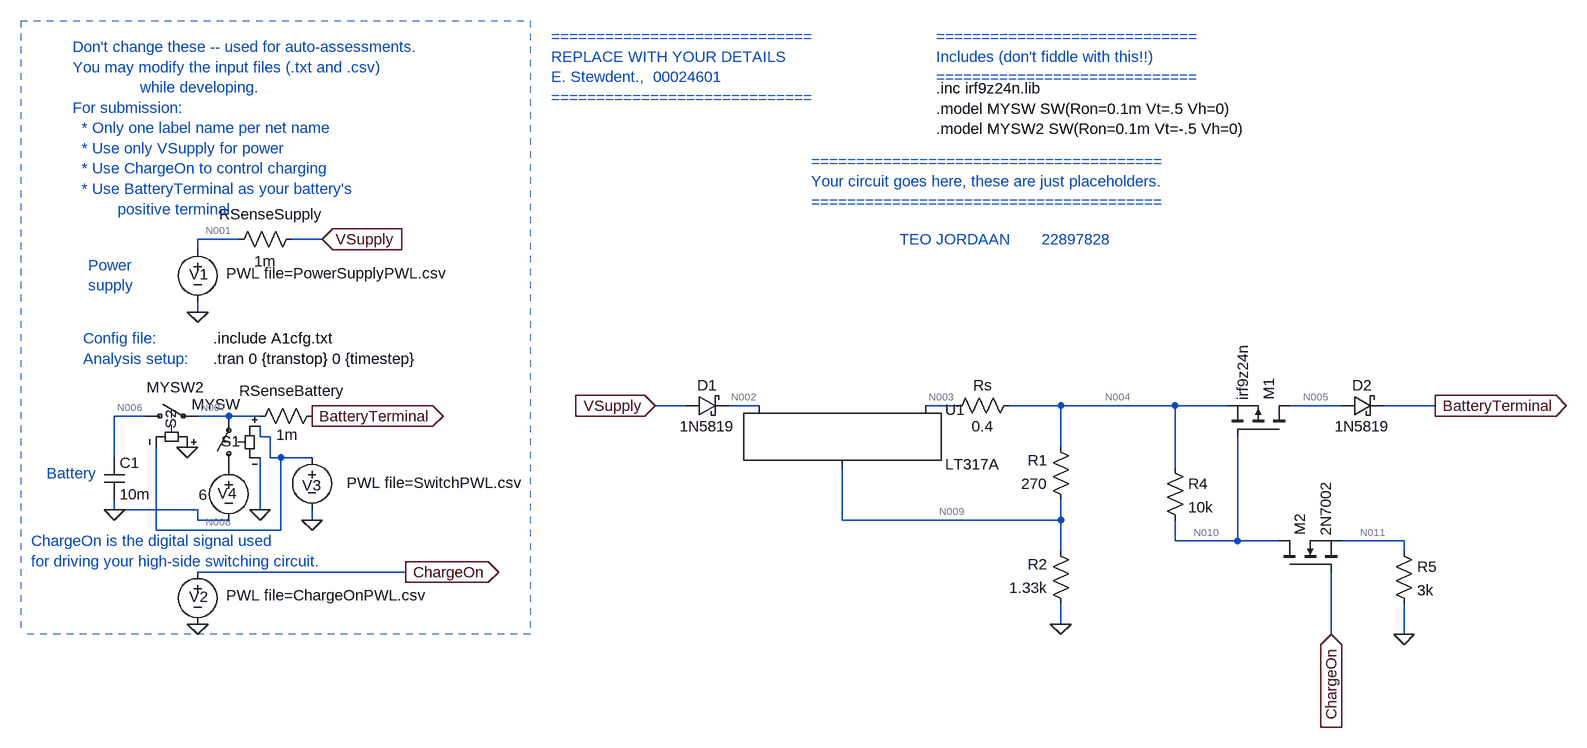
[diagram p0: schematic E344_A22897828_A2.asc]
E344_A22897828_A2.asc, the LTspice schematic file:
Version 4
SHEET 1 1824 680
WIRE -2032 -1088 -2096 -1088
WIRE -1904 -1088 -1952 -1088
WIRE -2096 -1072 -2096 -1088
WIRE -2096 -976 -2096 -992
WIRE -1344 -832 -1392 -832
WIRE -1232 -832 -1280 -832
WIRE -928 -832 -976 -832
WIRE -768 -832 -848 -832
WIRE -592 -832 -768 -832
WIRE -512 -832 -592 -832
WIRE -336 -832 -416 -832
WIRE -192 -832 -272 -832
WIRE -2176 -816 -2224 -816
WIRE -2048 -816 -2096 -816
WIRE -2000 -816 -2048 -816
WIRE -2000 -784 -2000 -800
WIRE -1984 -784 -2000 -784
WIRE -768 -768 -768 -832
WIRE -2224 -752 -2224 -816
WIRE -1984 -752 -1984 -784
WIRE -1968 -752 -1984 -752
WIRE -1920 -752 -1968 -752
WIRE -592 -736 -592 -832
WIRE -2224 -672 -2224 -688
WIRE -2096 -672 -2224 -672
WIRE -2000 -672 -2000 -752
WIRE -2096 -656 -2096 -672
WIRE -2048 -656 -2096 -656
WIRE -1920 -656 -1920 -672
WIRE -1104 -656 -1104 -736
WIRE -768 -656 -768 -688
WIRE -768 -656 -1104 -656
WIRE -2160 -640 -2160 -768
WIRE -1968 -640 -1968 -752
WIRE -1968 -640 -2160 -640
WIRE -592 -624 -592 -656
WIRE -496 -624 -496 -784
WIRE -496 -624 -592 -624
WIRE -432 -624 -496 -624
WIRE -240 -624 -336 -624
WIRE -768 -608 -768 -656
WIRE -240 -608 -240 -624
WIRE -1776 -576 -2096 -576
WIRE -768 -496 -768 -528
WIRE -352 -480 -352 -576
WIRE -240 -480 -240 -528
FLAG -2096 -976 0
FLAG -1904 -1088 VSupply
IOPIN -1904 -1088 In
FLAG -1920 -816 BatteryTerminal
IOPIN -1920 -816 Out
FLAG -1776 -576 ChargeOn
IOPIN -1776 -576 Out
FLAG -2096 -496 0
FLAG -1392 -832 VSupply
IOPIN -1392 -832 In
FLAG -192 -832 BatteryTerminal
IOPIN -192 -832 Out
FLAG -352 -480 ChargeOn
IOPIN -352 -480 In
FLAG -2000 -672 0
FLAG -1920 -656 0
FLAG -2112 -768 0
FLAG -2224 -672 0
FLAG -768 -496 0
FLAG -240 -480 0
SYMBOL voltage -2096 -1088 R0
WINDOW 123 0 0 Left 0
WINDOW 39 0 0 Left 0
WINDOW 3 44 52 Left 2
WINDOW 0 -13 54 Left 2
SYMATTR Value PWL file=PowerSupplyPWL.csv
SYMATTR InstName V1
SYMBOL res -1904 -832 R90
WINDOW 0 -7 47 VBottom 2
WINDOW 3 29 54 VTop 2
SYMATTR InstName RSenseBattery
SYMATTR Value 1m
SYMBOL res -1936 -1104 R90
WINDOW 0 -7 47 VBottom 2
WINDOW 3 34 56 VTop 2
SYMATTR InstName RSenseSupply
SYMATTR Value 1m
SYMBOL cap -2240 -752 R0
SYMATTR InstName C1
SYMATTR Value 10m
SYMATTR SpiceLine2 IC=6
SYMBOL voltage -2096 -592 R0
WINDOW 123 0 0 Left 0
WINDOW 39 0 0 Left 0
WINDOW 3 44 52 Left 2
WINDOW 0 -13 54 Left 2
SYMATTR Value PWL file=ChargeOnPWL.csv
SYMATTR InstName V2
SYMBOL PowerProducts\\LT317A -1104 -832 R0
SYMATTR InstName U1
SYMBOL pmos -416 -784 M270
SYMATTR InstName M1
SYMATTR Value irf9z24n
SYMATTR Prefix X
SYMATTR SpiceModel irf9z24n
SYMBOL nmos -432 -576 R270
SYMATTR InstName M2
SYMATTR Value 2N7002
SYMBOL schottky -1344 -816 R270
WINDOW 0 32 32 VTop 2
WINDOW 3 0 32 VBottom 2
SYMATTR InstName D1
SYMATTR Value 1N5819
SYMATTR Description Diode
SYMATTR Type diode
SYMBOL schottky -336 -816 R270
WINDOW 0 32 32 VTop 2
WINDOW 3 0 32 VBottom 2
SYMATTR InstName D2
SYMATTR Value 1N5819
SYMATTR Description Diode
SYMATTR Type diode
SYMBOL sw -2048 -720 R180
WINDOW 0 -18 57 Left 2
WINDOW 3 -17 114 Left 2
SYMATTR InstName S1
SYMATTR Value MYSW
SYMBOL voltage -1920 -768 R0
WINDOW 0 0 43 Top 2
WINDOW 3 188 70 Bottom 2
WINDOW 123 0 0 Left 0
WINDOW 39 0 0 Left 0
SYMATTR InstName V3
SYMATTR Value PWL file=SwitchPWL.csv
SYMBOL sw -2192 -816 R270
WINDOW 0 -20 55 Left 2
WINDOW 3 44 18 VRight 2
SYMATTR InstName S2
SYMATTR Value MYSW2
SYMBOL voltage -2048 -752 R0
WINDOW 0 -17 55 Left 2
WINDOW 3 -46 57 Left 2
WINDOW 123 0 0 Left 0
WINDOW 39 0 0 Left 0
SYMATTR InstName V4
SYMATTR Value 6
SYMBOL res -832 -848 R90
WINDOW 0 0 56 VBottom 2
WINDOW 3 32 56 VTop 2
SYMATTR InstName Rs
SYMATTR Value 0.4
SYMBOL res -752 -672 R180
WINDOW 0 36 76 Left 2
WINDOW 3 36 40 Left 2
SYMATTR InstName R1
SYMATTR Value 270
SYMBOL res -752 -512 R180
WINDOW 0 36 76 Left 2
WINDOW 3 36 40 Left 2
SYMATTR InstName R2
SYMATTR Value 1.33k
SYMBOL res -608 -752 R0
SYMATTR InstName R4
SYMATTR Value 10k
SYMBOL res -256 -624 R0
SYMATTR InstName R5
SYMATTR Value 3k
TEXT -2072 -904 Left 2 !.tran 0 {transtop} 0 {timestep}
TEXT -2072 -936 Left 2 !.include A1cfg.txt
TEXT -2288 -1384 Left 2 ;Don't change these -- used for auto-assessments.\nYou may modify the input files (.txt and .csv) \n               while developing.\nFor submission: \n  * Only one label name per net name\n  * Use only VSupply for power\n  * Use ChargeOn to control charging\n  * Use BatteryTerminal as your battery's \n          positive terminal
TEXT -2272 -936 Left 2 ;Config file:
TEXT -2272 -904 Left 2 ;Analysis setup:
TEXT -2328 -728 Left 2 ;Battery
TEXT -2264 -1048 Left 2 ;Power\nsupply
TEXT -1552 -1400 Left 2 ;=============================\nREPLACE WITH YOUR DETAILS\nE. Stewdent.,  00024601\n=============================
TEXT -960 -1320 Left 2 !.inc irf9z24n.lib\n.model MYSW SW(Ron=0.1m Vt=.5 Vh=0)\n.model MYSW2 SW(Ron=0.1m Vt=-.5 Vh=0)
TEXT -2352 -624 Left 2 ;ChargeOn is the digital signal used \nfor driving your high-side switching circuit.
TEXT -960 -1400 Left 2 ;=============================\nIncludes (don't fiddle with this!!)\n=============================
TEXT -1152 -1208 Left 2 ;=======================================\nYour circuit goes here, these are just placeholders.\n=======================================
TEXT -1016 -1088 Left 2 ;TEO JORDAAN       22897828
LINE Normal -1584 -1424 -1584 -480 2
LINE Normal -2368 -1424 -1584 -1424 2
LINE Normal -1584 -480 -2368 -480 2
LINE Normal -1584 -496 -1584 -496 2
LINE Normal -2368 -1424 -2368 -480 2

The netlist it stands for:
* E344_A22897828_A2.asc
V1 N001 0 PWL file=PowerSupplyPWL.csv
RSenseBattery BatteryTerminal N007 1m
RSenseSupply VSupply N001 1m
C1 N006 0 10m IC=6
V2 ChargeOn 0 PWL file=ChargeOnPWL.csv
XU1 N009 N003 N002 LT317A
XM1 N005 N010 N004 irf9z24n irf9z24n  ; pins D G S
M2 N010 ChargeOn N011 N011 2N7002
D1 VSupply N002 1N5819
D2 N005 BatteryTerminal 1N5819
S1 P001 N007 N008 0 MYSW
V3 N008 0 PWL file=SwitchPWL.csv
S2 N006 N007 0 N008 MYSW2
V4 P001 0 6
Rs N004 N003 0.4
R1 N009 N004 270
R2 0 N009 1.33k
R4 N004 N010 10k
R5 N011 0 3k
.model D D
.lib standard.dio
.model NMOS NMOS
.model PMOS PMOS
.lib standard.mos
.tran 0 {transtop} 0 {timestep}
.include A1cfg.txt
* Don't change these -- used for auto-assessments.
* You may modify the input files (.txt and .csv)
*                while developing.
* For submission:
*   * Only one label name per net name
*   * Use only VSupply for power
*   * Use ChargeOn to control charging
*   * Use BatteryTerminal as your battery's
*           positive terminal
* Config file:
* Analysis setup:
* Battery
* Power
* supply
* =============================
* REPLACE WITH YOUR DETAILS
* E. Stewdent.,  00024601
* =============================
.inc irf9z24n.lib
.model MYSW SW(Ron=0.1m Vt=.5 Vh=0)
.model MYSW2 SW(Ron=0.1m Vt=-.5 Vh=0)
* ChargeOn is the digital signal used
* for driving your high-side switching circuit.
* =============================
* Includes (don't fiddle with this!!)
* =============================
* =======================================
* Your circuit goes here, these are just placeholders.
* =======================================
* TEO JORDAAN       22897828
.lib LTC.lib
.backanno
.end

* Results of the author's LTspice run, read from the files saved beside the schematic
* Operating Point, zero values left out:
*   V(n001) = 12 V
*   V(batteryterminal) = 6 V
*   V(n007) = 6 V
*   V(vsupply) = 12 V
*   V(n006) = 6 V
*   V(n002) = 11.82 V
*   V(n003) = 7.446 V
*   V(n009) = 6.199 V
*   V(n004) = 7.445 V
*   V(n005) = 6.001 V
*   V(n010) = 7.445 V
*   V(n011) = 44.79 nV
*   V(p001) = 6 V
*   V(n008) = 1 V
*   Id(M2) = 7.48 pA
*   Is(M2) = -7.48 pA
*   I(D2) = 656.4 nA
*   I(D1) = 4.662 mA
*   I(R5) = 14.93 pA
*   I(R4) = 16.37 pA
*   I(R2) = -4.661 mA
*   I(R1) = -4.613 mA
*   I(Rs) = -4.614 mA
*   I(Rsensesupply) = -4.662 mA
*   I(Rsensebattery) = 656.4 nA
*   I(S1) = 656.3 nA
*   I(V4) = 656.3 nA
*   I(V1) = -4.662 mA
*   Ix(u1:1) = -47.52 µA
*   Ix(u1:2) = -4.614 mA
*   Ix(u1:3) = 4.662 mA
*   Ix(m1:1) = -656.4 nA
*   Ix(m1:2) = 1.444 pA
*   Ix(m1:3) = 656.4 nA
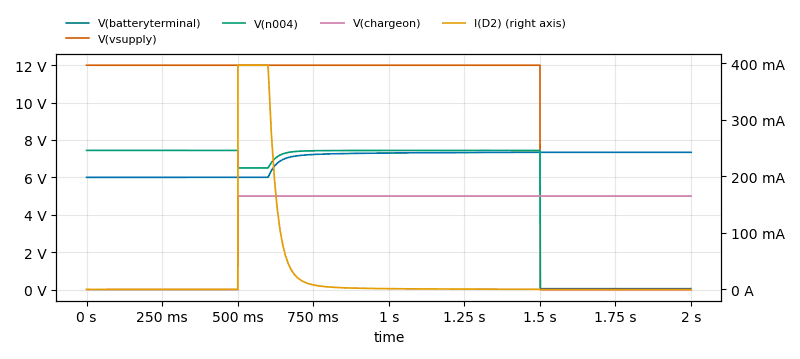
[diagram p1: Transient Analysis of E344_A22897828_A2.asc, plotted from the saved traces]
* Transient Analysis, 1 run:
*   V(batteryterminal): min 6 V, max 7.343 V, average 6.898 V, rms 6.925 V, last 7.341 V
*   V(vsupply): min 0 V, max 12 V, average 9.003 V, rms 10.39 V, last 0 V
*   V(n004): min 45.16 mV, max 7.445 V, average 5.533 V, rms 6.378 V, last 45.16 mV
*   V(chargeon): min 0 V, max 5 V, average 3.749 V, rms 4.329 V, last 5 V
*   I(D2): min -32.78 µA, max 396.6 mA, average 26.58 mA, rms 95.32 mA, last -31.7 µA